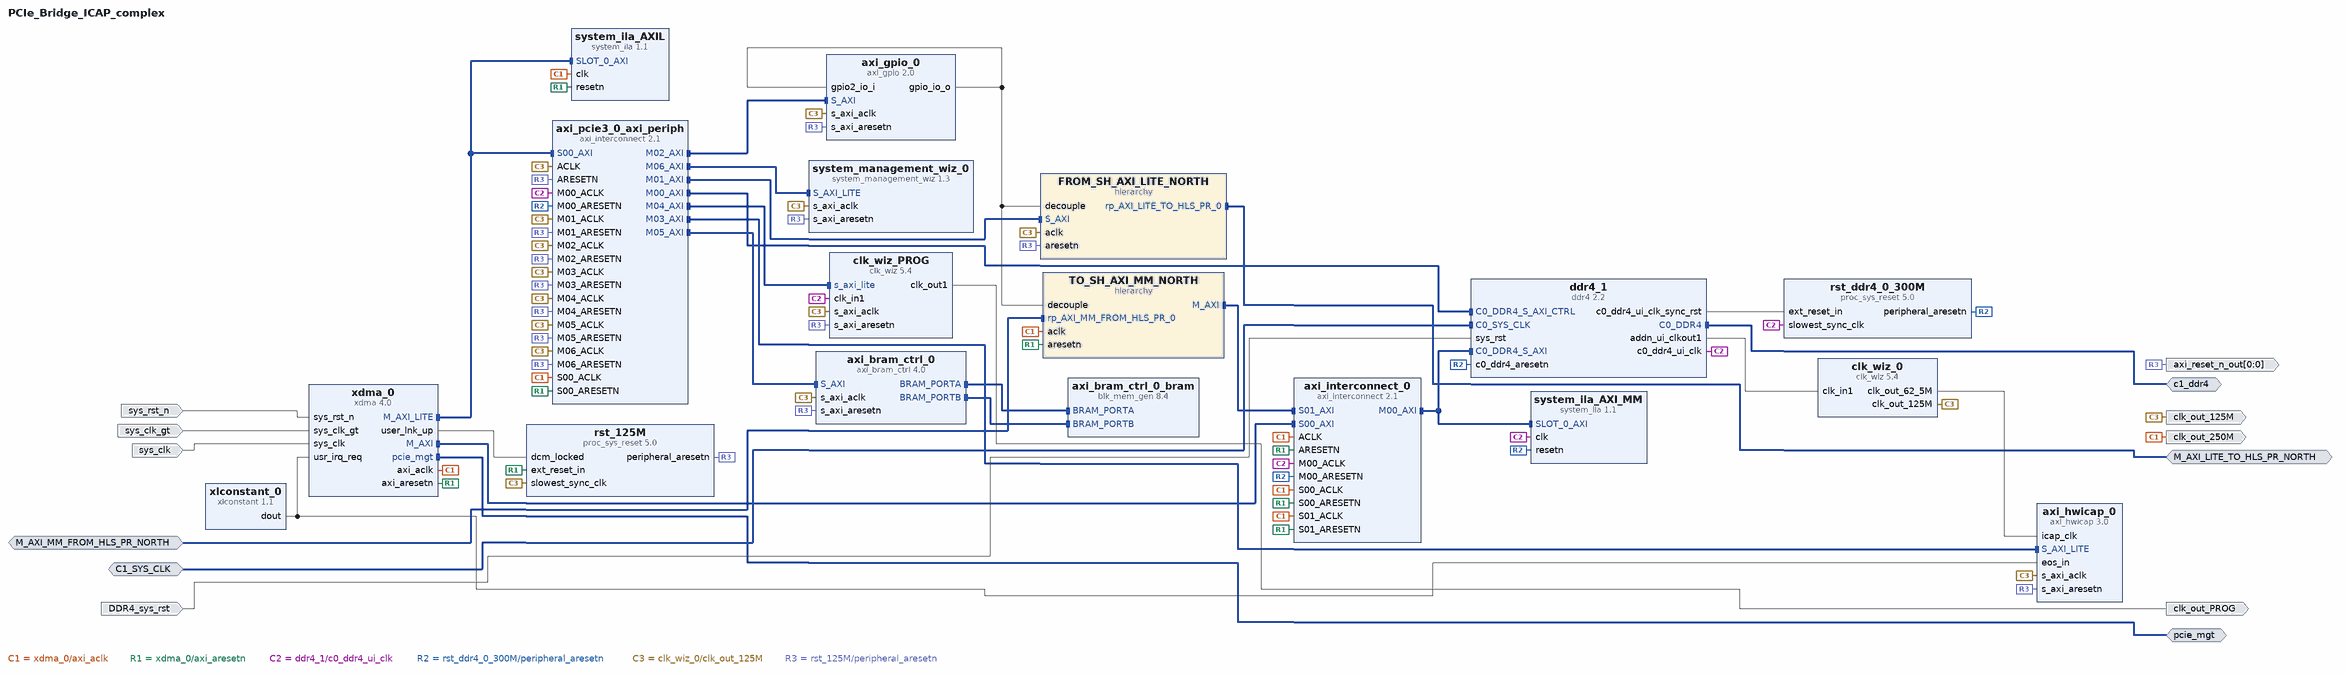
[diagram p0: block diagram of the top level]
# Vivado block design PCIe_Bridge_ICAP_complex, xcvu9p-fsgd2104-2-i, Vivado 2017.4
create_bd_design PCIe_Bridge_ICAP_complex

create_bd_intf_port -mode Master -vlnv xilinx.com:interface:pcie_7x_mgt_rtl:1.0 pcie_mgt
create_bd_intf_port -mode Master -vlnv xilinx.com:interface:ddr4_rtl:1.0 c1_ddr4
create_bd_intf_port -mode Slave -vlnv xilinx.com:interface:aximm_rtl:1.0 M_AXI_MM_FROM_HLS_PR_NORTH
set_property -dict [list \
  CONFIG.DATA_WIDTH 512 \
  CONFIG.PROTOCOL AXI4 \
  CONFIG.ID_WIDTH 0 \
  CONFIG.ADDR_WIDTH 64 \
  CONFIG.AWUSER_WIDTH 0 \
  CONFIG.ARUSER_WIDTH 0 \
  CONFIG.WUSER_WIDTH 0 \
  CONFIG.RUSER_WIDTH 0 \
  CONFIG.BUSER_WIDTH 0 \
  CONFIG.READ_WRITE_MODE READ_WRITE \
  CONFIG.HAS_BURST 1 \
  CONFIG.HAS_LOCK 1 \
  CONFIG.HAS_PROT 1 \
  CONFIG.HAS_CACHE 1 \
  CONFIG.HAS_QOS 1 \
  CONFIG.HAS_REGION 1 \
  CONFIG.HAS_WSTRB 1 \
  CONFIG.HAS_BRESP 1 \
  CONFIG.HAS_RRESP 1 \
  CONFIG.SUPPORTS_NARROW_BURST 1 \
  CONFIG.NUM_READ_OUTSTANDING 32 \
  CONFIG.NUM_WRITE_OUTSTANDING 32 \
  CONFIG.MAX_BURST_LENGTH 256 \
  CONFIG.NUM_READ_THREADS 1 \
  CONFIG.NUM_WRITE_THREADS 1 \
  CONFIG.RUSER_BITS_PER_BYTE 0 \
  CONFIG.WUSER_BITS_PER_BYTE 0 \
] [get_bd_intf_ports M_AXI_MM_FROM_HLS_PR_NORTH]
create_bd_intf_port -mode Master -vlnv xilinx.com:interface:aximm_rtl:1.0 M_AXI_LITE_TO_HLS_PR_NORTH
set_property -dict [list \
  CONFIG.DATA_WIDTH 32 \
  CONFIG.PROTOCOL AXI4LITE \
  CONFIG.ADDR_WIDTH 32 \
  CONFIG.HAS_BURST 0 \
  CONFIG.HAS_QOS 0 \
  CONFIG.HAS_REGION 0 \
] [get_bd_intf_ports M_AXI_LITE_TO_HLS_PR_NORTH]
create_bd_intf_port -mode Slave -vlnv xilinx.com:interface:diff_clock_rtl:1.0 C1_SYS_CLK
set_property -dict {CONFIG.FREQ_HZ 300000000} [get_bd_intf_ports C1_SYS_CLK]
create_bd_port -dir O -type clk clk_out_250M
set_property -dict {CONFIG.ASSOCIATED_BUSIF M_AXI_MM_FROM_HLS_PR_NORTH} [get_bd_ports clk_out_250M]
create_bd_port -dir I -type rst DDR4_sys_rst
set_property -dict {CONFIG.POLARITY ACTIVE_HIGH} [get_bd_ports DDR4_sys_rst]
create_bd_port -dir I -type rst sys_rst_n
create_bd_port -dir I -type clk sys_clk_gt
create_bd_port -dir I -type clk sys_clk
create_bd_port -dir O -type clk clk_out_125M
set_property -dict [list \
  CONFIG.ASSOCIATED_BUSIF M_AXI_LITE_TO_HLS_PR_NORTH \
  CONFIG.ASSOCIATED_RESET axi_reset_n_out \
] [get_bd_ports clk_out_125M]
create_bd_port -dir O -from 0 -to 0 -type rst axi_reset_n_out
create_bd_port -dir O -type clk clk_out_PROG
set_property -dict {CONFIG.FREQ_HZ 400000000} [get_bd_ports clk_out_PROG]

create_bd_cell -type hier TO_SH_AXI_MM_NORTH
create_bd_cell -type hier FROM_SH_AXI_LITE_NORTH
create_bd_cell -type ip -vlnv xilinx.com:ip:axi_gpio:2.0 axi_gpio_0
set_property -dict [list \
  CONFIG.C_GPIO_WIDTH 1 \
  CONFIG.C_GPIO2_WIDTH 1 \
  CONFIG.C_IS_DUAL 1 \
  CONFIG.C_ALL_INPUTS_2 1 \
  CONFIG.C_ALL_OUTPUTS 1 \
] [get_bd_cells axi_gpio_0]
create_bd_cell -type ip -vlnv xilinx.com:ip:axi_hwicap:3.0 axi_hwicap_0
set_property -dict {CONFIG.C_FAMILY kintexu} [get_bd_cells axi_hwicap_0]
create_bd_cell -type ip -vlnv xilinx.com:ip:axi_interconnect:2.1 axi_interconnect_0
set_property -dict [list \
  CONFIG.NUM_SI 2 \
  CONFIG.NUM_MI 1 \
  CONFIG.SYNCHRONIZATION_STAGES 2 \
  CONFIG.M00_HAS_REGSLICE 4 \
  CONFIG.M01_HAS_REGSLICE 4 \
  CONFIG.M00_HAS_DATA_FIFO 0 \
  CONFIG.S00_HAS_REGSLICE 4 \
  CONFIG.S01_HAS_REGSLICE 4 \
  CONFIG.S02_HAS_REGSLICE 4 \
  CONFIG.S03_HAS_REGSLICE 4 \
  CONFIG.S00_HAS_DATA_FIFO 0 \
  CONFIG.S01_HAS_DATA_FIFO 0 \
  CONFIG.S02_HAS_DATA_FIFO 0 \
  CONFIG.S03_HAS_DATA_FIFO 0 \
] [get_bd_cells axi_interconnect_0]
create_bd_cell -type ip -vlnv xilinx.com:ip:axi_interconnect:2.1 axi_pcie3_0_axi_periph
set_property -dict [list \
  CONFIG.NUM_MI 7 \
  CONFIG.SYNCHRONIZATION_STAGES 2 \
  CONFIG.M00_HAS_REGSLICE 4 \
  CONFIG.M01_HAS_REGSLICE 4 \
  CONFIG.M02_HAS_REGSLICE 4 \
  CONFIG.M03_HAS_REGSLICE 4 \
  CONFIG.M04_HAS_REGSLICE 4 \
  CONFIG.S00_HAS_REGSLICE 4 \
] [get_bd_cells axi_pcie3_0_axi_periph]
create_bd_cell -type ip -vlnv xilinx.com:ip:clk_wiz:5.4 clk_wiz_0
set_property -dict [list \
  CONFIG.USE_FREQ_SYNTH true \
  CONFIG.USE_PHASE_ALIGNMENT false \
  CONFIG.JITTER_SEL Min_O_Jitter \
  CONFIG.PHASESHIFT_MODE WAVEFORM \
  CONFIG.SECONDARY_SOURCE Single_ended_clock_capable_pin \
  CONFIG.CLKIN1_JITTER_PS 40.0 \
  CONFIG.CLKOUT2_USED true \
  CONFIG.CLKOUT3_USED false \
  CONFIG.NUM_OUT_CLKS 2 \
  CONFIG.CLK_OUT1_PORT clk_out_125M \
  CONFIG.CLK_OUT2_PORT clk_out_62_5M \
  CONFIG.CLK_OUT3_PORT clk_out3 \
  CONFIG.CLKOUT1_REQUESTED_OUT_FREQ 125.000 \
  CONFIG.CLKOUT2_REQUESTED_OUT_FREQ 62.5 \
  CONFIG.CLKOUT3_REQUESTED_OUT_FREQ 100.000 \
  CONFIG.PRIM_SOURCE No_buffer \
  CONFIG.CLKOUT1_DRIVES BUFG \
  CONFIG.CLKOUT2_DRIVES BUFG \
  CONFIG.CLKOUT3_DRIVES Buffer \
  CONFIG.CLKOUT4_DRIVES Buffer \
  CONFIG.CLKOUT5_DRIVES Buffer \
  CONFIG.CLKOUT6_DRIVES Buffer \
  CONFIG.CLKOUT7_DRIVES Buffer \
  CONFIG.FEEDBACK_SOURCE FDBK_AUTO \
  CONFIG.USE_LOCKED false \
  CONFIG.USE_RESET false \
  CONFIG.MMCM_DIVCLK_DIVIDE 1 \
  CONFIG.MMCM_BANDWIDTH HIGH \
  CONFIG.MMCM_CLKFBOUT_MULT_F 6.250 \
  CONFIG.MMCM_CLKIN1_PERIOD 4.000 \
  CONFIG.MMCM_CLKIN2_PERIOD 10.0 \
  CONFIG.MMCM_CLKOUT0_DIVIDE_F 12.500 \
  CONFIG.MMCM_CLKOUT1_DIVIDE 25 \
  CONFIG.MMCM_CLKOUT2_DIVIDE 1 \
  CONFIG.CLKOUT1_JITTER 88.976 \
  CONFIG.CLKOUT1_PHASE_ERROR 71.064 \
  CONFIG.CLKOUT2_JITTER 101.705 \
  CONFIG.CLKOUT2_PHASE_ERROR 71.064 \
  CONFIG.CLKOUT3_JITTER 79.446 \
  CONFIG.CLKOUT3_PHASE_ERROR 72.667 \
] [get_bd_cells clk_wiz_0]
create_bd_cell -type ip -vlnv xilinx.com:ip:clk_wiz:5.4 clk_wiz_PROG
set_property -dict [list \
  CONFIG.USE_PHASE_ALIGNMENT false \
  CONFIG.USE_DYN_RECONFIG true \
  CONFIG.JITTER_SEL Min_O_Jitter \
  CONFIG.SECONDARY_SOURCE Single_ended_clock_capable_pin \
  CONFIG.CLKIN1_JITTER_PS 33.330000000000005 \
  CONFIG.CLKOUT1_REQUESTED_OUT_FREQ 400.000 \
  CONFIG.PRIM_SOURCE No_buffer \
  CONFIG.CLKOUT1_DRIVES Buffer \
  CONFIG.CLKOUT2_DRIVES Buffer \
  CONFIG.CLKOUT3_DRIVES Buffer \
  CONFIG.CLKOUT4_DRIVES Buffer \
  CONFIG.CLKOUT5_DRIVES Buffer \
  CONFIG.CLKOUT6_DRIVES Buffer \
  CONFIG.CLKOUT7_DRIVES Buffer \
  CONFIG.MMCM_DIVCLK_DIVIDE 3 \
  CONFIG.MMCM_BANDWIDTH HIGH \
  CONFIG.MMCM_CLKFBOUT_MULT_F 15.500 \
  CONFIG.MMCM_CLKIN1_PERIOD 3.333 \
  CONFIG.MMCM_CLKIN2_PERIOD 10.0 \
  CONFIG.MMCM_CLKOUT0_DIVIDE_F 3.875 \
  CONFIG.CLKOUT1_JITTER 71.763 \
  CONFIG.CLKOUT1_PHASE_ERROR 75.042 \
] [get_bd_cells clk_wiz_PROG]
create_bd_cell -type ip -vlnv xilinx.com:ip:ddr4:2.2 ddr4_1
set_property -dict [list \
  CONFIG.C0.DDR4_TimePeriod 833 \
  CONFIG.C0.DDR4_InputClockPeriod 3332 \
  CONFIG.C0.DDR4_MemoryType RDIMMs \
  CONFIG.C0.DDR4_MemoryPart MTA18ASF2G72PZ-2G3 \
  CONFIG.C0.DDR4_DataWidth 72 \
  CONFIG.C0.DDR4_CasLatency 17 \
  CONFIG.C0.DDR4_CasWriteLatency 12 \
  CONFIG.C0.DDR4_AxiDataWidth 512 \
  CONFIG.C0.DDR4_AxiAddressWidth 34 \
  CONFIG.ADDN_UI_CLKOUT1_FREQ_HZ 250 \
  CONFIG.C0.BANK_GROUP_WIDTH 2 \
  CONFIG.C0.CKE_WIDTH 1 \
  CONFIG.C0.CS_WIDTH 1 \
  CONFIG.C0.ODT_WIDTH 1 \
] [get_bd_cells ddr4_1]
create_bd_cell -type ip -vlnv xilinx.com:ip:proc_sys_reset:5.0 rst_ddr4_0_300M
create_bd_cell -type ip -vlnv xilinx.com:ip:proc_sys_reset:5.0 rst_125M
create_bd_cell -type ip -vlnv xilinx.com:ip:system_ila:1.1 system_ila_AXI_MM
set_property -dict [list \
  CONFIG.C_SLOT_0_MAX_RD_BURSTS 32 \
  CONFIG.C_SLOT_0_MAX_WR_BURSTS 32 \
  CONFIG.C_SLOT_0_TXN_CNTR_EN 0 \
  CONFIG.C_SLOT_0_AXI_W_SEL_TRIG 0 \
  CONFIG.C_SLOT_0_AXI_B_SEL_TRIG 0 \
  CONFIG.C_SLOT_0_AXI_R_SEL_TRIG 0 \
  CONFIG.C_INPUT_PIPE_STAGES 4 \
  CONFIG.ALL_PROBE_SAME_MU true \
  CONFIG.C_MON_TYPE INTERFACE \
] [get_bd_cells system_ila_AXI_MM]
create_bd_cell -type ip -vlnv xilinx.com:ip:xdma:4.0 xdma_0
set_property -dict [list \
  CONFIG.mode_selection Advanced \
  CONFIG.pcie_blk_locn X1Y2 \
  CONFIG.pl_link_cap_max_link_width X16 \
  CONFIG.pl_link_cap_max_link_speed 8.0_GT/s \
  CONFIG.axi_data_width 512_bit \
  CONFIG.axisten_freq 250 \
  CONFIG.pipe_sim false \
  CONFIG.pf0_device_id 903F \
  CONFIG.axilite_master_en true \
  CONFIG.axilite_master_size 32 \
  CONFIG.axilite_master_scale Megabytes \
  CONFIG.pf0_interrupt_pin NONE \
  CONFIG.pf0_msi_enabled true \
  CONFIG.plltype QPLL1 \
  CONFIG.pf0_msix_enabled true \
  CONFIG.pf0_msix_cap_table_size 020 \
  CONFIG.pf0_msix_cap_table_offset 00008000 \
  CONFIG.pf0_msix_cap_table_bir BAR_1 \
  CONFIG.pf0_msix_cap_pba_offset 00008FE0 \
  CONFIG.pf0_msix_cap_pba_bir BAR_1 \
  CONFIG.cfg_mgmt_if false \
] [get_bd_cells xdma_0]
create_bd_cell -type ip -vlnv xilinx.com:ip:xlconstant:1.1 xlconstant_0
set_property -dict {CONFIG.CONST_VAL 0} [get_bd_cells xlconstant_0]
create_bd_cell -type ip -vlnv xilinx.com:ip:axi_bram_ctrl:4.0 axi_bram_ctrl_0
create_bd_cell -type ip -vlnv xilinx.com:ip:blk_mem_gen:8.4 axi_bram_ctrl_0_bram
set_property -dict {CONFIG.Memory_Type True_Dual_Port_RAM} [get_bd_cells axi_bram_ctrl_0_bram]
create_bd_cell -type ip -vlnv xilinx.com:ip:system_ila:1.1 system_ila_AXIL
create_bd_cell -type ip -vlnv xilinx.com:ip:system_management_wiz:1.3 system_management_wiz_0
set_property -dict [list \
  CONFIG.TEMPERATURE_ALARM_OT_TRIGGER 95.0 \
  CONFIG.CHANNEL_ENABLE_VP_VN false \
] [get_bd_cells system_management_wiz_0]

# ---- hierarchy /TO_SH_AXI_MM_NORTH ----
current_bd_instance /TO_SH_AXI_MM_NORTH
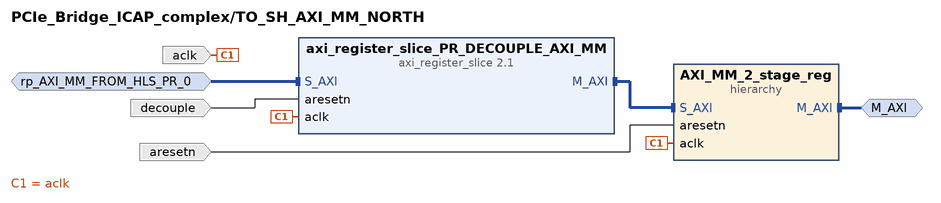
[diagram p1: block diagram inside /TO_SH_AXI_MM_NORTH]
create_bd_intf_pin -mode Master -vlnv xilinx.com:interface:aximm_rtl:1.0 M_AXI
create_bd_intf_pin -mode Slave -vlnv xilinx.com:interface:aximm_rtl:1.0 rp_AXI_MM_FROM_HLS_PR_0
create_bd_pin -dir I -type clk aclk
create_bd_pin -dir I -type rst aresetn
create_bd_pin -dir I decouple

create_bd_cell -type hier AXI_MM_2_stage_reg
create_bd_cell -type ip -vlnv xilinx.com:ip:axi_register_slice:2.1 axi_register_slice_PR_DECOUPLE_AXI_MM

# ---- hierarchy /TO_SH_AXI_MM_NORTH/AXI_MM_2_stage_reg ----
current_bd_instance /TO_SH_AXI_MM_NORTH/AXI_MM_2_stage_reg
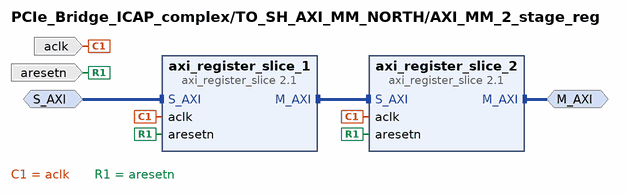
[diagram p2: block diagram inside /TO_SH_AXI_MM_NORTH/AXI_MM_2_stage_reg]
create_bd_intf_pin -mode Master -vlnv xilinx.com:interface:aximm_rtl:1.0 M_AXI
create_bd_intf_pin -mode Slave -vlnv xilinx.com:interface:aximm_rtl:1.0 S_AXI
create_bd_pin -dir I -type clk aclk
create_bd_pin -dir I -type rst aresetn

create_bd_cell -type ip -vlnv xilinx.com:ip:axi_register_slice:2.1 axi_register_slice_1
create_bd_cell -type ip -vlnv xilinx.com:ip:axi_register_slice:2.1 axi_register_slice_2

# ---- hierarchy /FROM_SH_AXI_LITE_NORTH ----
current_bd_instance /FROM_SH_AXI_LITE_NORTH
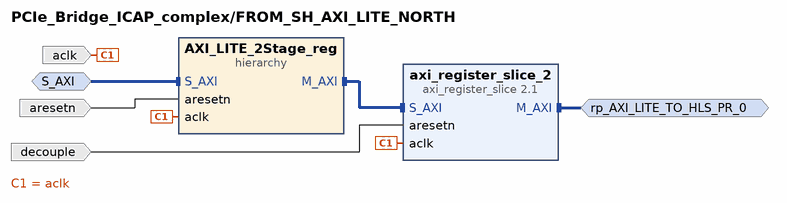
[diagram p3: block diagram inside /FROM_SH_AXI_LITE_NORTH]
create_bd_intf_pin -mode Slave -vlnv xilinx.com:interface:aximm_rtl:1.0 S_AXI
create_bd_intf_pin -mode Master -vlnv xilinx.com:interface:aximm_rtl:1.0 rp_AXI_LITE_TO_HLS_PR_0
create_bd_pin -dir I -type clk aclk
create_bd_pin -dir I -type rst aresetn
create_bd_pin -dir I decouple

create_bd_cell -type hier AXI_LITE_2Stage_reg
create_bd_cell -type ip -vlnv xilinx.com:ip:axi_register_slice:2.1 axi_register_slice_2
set_property -dict {CONFIG.REG_W 7 CONFIG.REG_R 7} [get_bd_cells axi_register_slice_2]

# ---- hierarchy /FROM_SH_AXI_LITE_NORTH/AXI_LITE_2Stage_reg ----
current_bd_instance /FROM_SH_AXI_LITE_NORTH/AXI_LITE_2Stage_reg
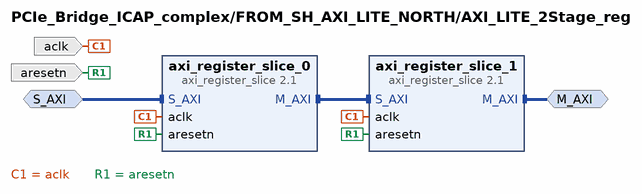
[diagram p4: block diagram inside /FROM_SH_AXI_LITE_NORTH/AXI_LITE_2Stage_reg]
create_bd_intf_pin -mode Slave -vlnv xilinx.com:interface:aximm_rtl:1.0 S_AXI
create_bd_intf_pin -mode Master -vlnv xilinx.com:interface:aximm_rtl:1.0 M_AXI
create_bd_pin -dir I -type clk aclk
create_bd_pin -dir I -type rst aresetn

create_bd_cell -type ip -vlnv xilinx.com:ip:axi_register_slice:2.1 axi_register_slice_0
set_property -dict {CONFIG.REG_W 7 CONFIG.REG_R 7} [get_bd_cells axi_register_slice_0]
create_bd_cell -type ip -vlnv xilinx.com:ip:axi_register_slice:2.1 axi_register_slice_1
set_property -dict {CONFIG.REG_W 7 CONFIG.REG_R 7} [get_bd_cells axi_register_slice_1]

# ---- connections ----

current_bd_instance /TO_SH_AXI_MM_NORTH
connect_bd_intf_net -intf_net axi_register_slice_0_M_AXI [get_bd_intf_pins axi_register_slice_PR_DECOUPLE_AXI_MM/M_AXI] [get_bd_intf_pins AXI_MM_2_stage_reg/S_AXI]
connect_bd_intf_net -intf_net AXI_MM_3_stage_reg_M_AXI [get_bd_intf_pins M_AXI] [get_bd_intf_pins AXI_MM_2_stage_reg/M_AXI]
connect_bd_intf_net -intf_net rp_AXI_MM_FROM_HLS_PR_0_1 [get_bd_intf_pins rp_AXI_MM_FROM_HLS_PR_0] [get_bd_intf_pins axi_register_slice_PR_DECOUPLE_AXI_MM/S_AXI]
connect_bd_net -net clk_wiz_0_clk_out_125M [get_bd_pins aclk] \
  [get_bd_pins axi_register_slice_PR_DECOUPLE_AXI_MM/aclk] [get_bd_pins AXI_MM_2_stage_reg/aclk]
connect_bd_net -net rst_ddr4_0_300M1_peripheral_aresetn [get_bd_pins aresetn] [get_bd_pins AXI_MM_2_stage_reg/aresetn]
connect_bd_net [get_bd_pins decouple] [get_bd_pins axi_register_slice_PR_DECOUPLE_AXI_MM/aresetn]

current_bd_instance /TO_SH_AXI_MM_NORTH/AXI_MM_2_stage_reg
connect_bd_intf_net [get_bd_intf_pins axi_register_slice_2/S_AXI] [get_bd_intf_pins axi_register_slice_1/M_AXI]
connect_bd_intf_net [get_bd_intf_pins M_AXI] [get_bd_intf_pins axi_register_slice_2/M_AXI]
connect_bd_intf_net [get_bd_intf_pins S_AXI] [get_bd_intf_pins axi_register_slice_1/S_AXI]
connect_bd_net -net axi_pcie3_0_axi_aclk [get_bd_pins aclk] [get_bd_pins axi_register_slice_1/aclk] [get_bd_pins axi_register_slice_2/aclk]
connect_bd_net -net axi_pcie3_0_axi_aresetn [get_bd_pins aresetn] \
  [get_bd_pins axi_register_slice_1/aresetn] [get_bd_pins axi_register_slice_2/aresetn]

current_bd_instance /FROM_SH_AXI_LITE_NORTH
connect_bd_intf_net -intf_net AXI_LITE_3Stage_reg_M_AXI [get_bd_intf_pins axi_register_slice_2/S_AXI] [get_bd_intf_pins AXI_LITE_2Stage_reg/M_AXI]
connect_bd_intf_net [get_bd_intf_pins S_AXI] [get_bd_intf_pins AXI_LITE_2Stage_reg/S_AXI]
connect_bd_intf_net [get_bd_intf_pins rp_AXI_LITE_TO_HLS_PR_0] [get_bd_intf_pins axi_register_slice_2/M_AXI]
connect_bd_net -net clk_wiz_0_clk_out_125M [get_bd_pins aclk] [get_bd_pins axi_register_slice_2/aclk] [get_bd_pins AXI_LITE_2Stage_reg/aclk]
connect_bd_net -net rst_ddr4_0_300M1_peripheral_aresetn [get_bd_pins aresetn] [get_bd_pins AXI_LITE_2Stage_reg/aresetn]
connect_bd_net [get_bd_pins decouple] [get_bd_pins axi_register_slice_2/aresetn]

current_bd_instance /FROM_SH_AXI_LITE_NORTH/AXI_LITE_2Stage_reg
connect_bd_intf_net [get_bd_intf_pins axi_register_slice_1/S_AXI] [get_bd_intf_pins axi_register_slice_0/M_AXI]
connect_bd_intf_net [get_bd_intf_pins S_AXI] [get_bd_intf_pins axi_register_slice_0/S_AXI]
connect_bd_intf_net [get_bd_intf_pins M_AXI] [get_bd_intf_pins axi_register_slice_1/M_AXI]
connect_bd_net [get_bd_pins aclk] [get_bd_pins axi_register_slice_0/aclk] [get_bd_pins axi_register_slice_1/aclk]
connect_bd_net [get_bd_pins aresetn] [get_bd_pins axi_register_slice_0/aresetn] [get_bd_pins axi_register_slice_1/aresetn]

current_bd_instance /
connect_bd_intf_net [get_bd_intf_pins axi_pcie3_0_axi_periph/S00_AXI] [get_bd_intf_pins xdma_0/M_AXI_LITE]
connect_bd_intf_net [get_bd_intf_pins axi_pcie3_0_axi_periph/S00_AXI] [get_bd_intf_pins system_ila_AXIL/SLOT_0_AXI]
connect_bd_intf_net [get_bd_intf_pins axi_interconnect_0/M00_AXI] [get_bd_intf_pins ddr4_1/C0_DDR4_S_AXI]
connect_bd_intf_net [get_bd_intf_pins axi_interconnect_0/M00_AXI] [get_bd_intf_pins system_ila_AXI_MM/SLOT_0_AXI]
connect_bd_intf_net [get_bd_intf_pins FROM_SH_AXI_LITE_NORTH/S_AXI] [get_bd_intf_pins axi_pcie3_0_axi_periph/M01_AXI]
connect_bd_intf_net -intf_net fifo_generator_1_M_AXI [get_bd_intf_pins TO_SH_AXI_MM_NORTH/M_AXI] [get_bd_intf_pins axi_interconnect_0/S01_AXI]
connect_bd_intf_net [get_bd_intf_pins axi_hwicap_0/S_AXI_LITE] [get_bd_intf_pins axi_pcie3_0_axi_periph/M03_AXI]
connect_bd_intf_net [get_bd_intf_pins axi_gpio_0/S_AXI] [get_bd_intf_pins axi_pcie3_0_axi_periph/M02_AXI]
connect_bd_intf_net [get_bd_intf_pins axi_pcie3_0_axi_periph/M00_AXI] [get_bd_intf_pins ddr4_1/C0_DDR4_S_AXI_CTRL]
connect_bd_intf_net [get_bd_intf_pins axi_interconnect_0/S00_AXI] [get_bd_intf_pins xdma_0/M_AXI]
connect_bd_intf_net [get_bd_intf_pins axi_pcie3_0_axi_periph/M04_AXI] [get_bd_intf_pins clk_wiz_PROG/s_axi_lite]
connect_bd_intf_net [get_bd_intf_pins axi_bram_ctrl_0_bram/BRAM_PORTA] [get_bd_intf_pins axi_bram_ctrl_0/BRAM_PORTA]
connect_bd_intf_net [get_bd_intf_pins axi_bram_ctrl_0_bram/BRAM_PORTB] [get_bd_intf_pins axi_bram_ctrl_0/BRAM_PORTB]
connect_bd_intf_net [get_bd_intf_pins axi_pcie3_0_axi_periph/M05_AXI] [get_bd_intf_pins axi_bram_ctrl_0/S_AXI]
connect_bd_intf_net [get_bd_intf_pins axi_pcie3_0_axi_periph/M06_AXI] [get_bd_intf_pins system_management_wiz_0/S_AXI_LITE]
connect_bd_intf_net [get_bd_intf_ports pcie_mgt] [get_bd_intf_pins xdma_0/pcie_mgt]
connect_bd_intf_net -intf_net ddr4_0_C0_DDR4 [get_bd_intf_ports c1_ddr4] [get_bd_intf_pins ddr4_1/C0_DDR4]
connect_bd_intf_net -intf_net M_AXI_MM_FROM_HLS_PR_0_1 [get_bd_intf_ports M_AXI_MM_FROM_HLS_PR_NORTH] [get_bd_intf_pins TO_SH_AXI_MM_NORTH/rp_AXI_MM_FROM_HLS_PR_0]
connect_bd_intf_net -intf_net FROM_SH_AXI_LITE_rp_AXI_LITE_TO_HLS_PR_0 [get_bd_intf_ports M_AXI_LITE_TO_HLS_PR_NORTH] [get_bd_intf_pins FROM_SH_AXI_LITE_NORTH/rp_AXI_LITE_TO_HLS_PR_0]
connect_bd_intf_net [get_bd_intf_ports C1_SYS_CLK] [get_bd_intf_pins ddr4_1/C0_SYS_CLK]
connect_bd_net -net axi_pcie3_0_axi_aclk [get_bd_pins xdma_0/axi_aclk] \
  [get_bd_ports clk_out_250M] [get_bd_pins system_ila_AXIL/clk] [get_bd_pins TO_SH_AXI_MM_NORTH/aclk] \
  [get_bd_pins axi_interconnect_0/ACLK] [get_bd_pins axi_interconnect_0/S00_ACLK] [get_bd_pins axi_interconnect_0/S01_ACLK] \
  [get_bd_pins axi_pcie3_0_axi_periph/S00_ACLK]
connect_bd_net -net axi_pcie3_0_axi_aresetn [get_bd_pins xdma_0/axi_aresetn] \
  [get_bd_pins rst_125M/ext_reset_in] [get_bd_pins system_ila_AXIL/resetn] [get_bd_pins TO_SH_AXI_MM_NORTH/aresetn] \
  [get_bd_pins axi_interconnect_0/ARESETN] [get_bd_pins axi_interconnect_0/S00_ARESETN] \
  [get_bd_pins axi_interconnect_0/S01_ARESETN] [get_bd_pins axi_pcie3_0_axi_periph/S00_ARESETN]
connect_bd_net -net ddr4_0_c0_ddr4_ui_clk [get_bd_pins ddr4_1/c0_ddr4_ui_clk] \
  [get_bd_pins clk_wiz_PROG/clk_in1] [get_bd_pins rst_ddr4_0_300M/slowest_sync_clk] [get_bd_pins system_ila_AXI_MM/clk] \
  [get_bd_pins axi_interconnect_0/M00_ACLK] [get_bd_pins axi_pcie3_0_axi_periph/M00_ACLK]
connect_bd_net -net ddr4_0_c0_ddr4_ui_clk_sync_rst [get_bd_pins ddr4_1/c0_ddr4_ui_clk_sync_rst] [get_bd_pins rst_ddr4_0_300M/ext_reset_in]
connect_bd_net [get_bd_pins rst_ddr4_0_300M/peripheral_aresetn] \
  [get_bd_pins ddr4_1/c0_ddr4_aresetn] [get_bd_pins system_ila_AXI_MM/resetn] [get_bd_pins axi_interconnect_0/M00_ARESETN] \
  [get_bd_pins axi_pcie3_0_axi_periph/M00_ARESETN]
connect_bd_net -net sys_rst_1 [get_bd_ports DDR4_sys_rst] [get_bd_pins ddr4_1/sys_rst]
connect_bd_net [get_bd_pins xlconstant_0/dout] [get_bd_pins xdma_0/usr_irq_req] [get_bd_pins axi_hwicap_0/eos_in]
connect_bd_net [get_bd_ports sys_rst_n] [get_bd_pins xdma_0/sys_rst_n]
connect_bd_net [get_bd_ports sys_clk_gt] [get_bd_pins xdma_0/sys_clk_gt]
connect_bd_net [get_bd_ports sys_clk] [get_bd_pins xdma_0/sys_clk]
connect_bd_net [get_bd_pins clk_wiz_0/clk_out_125M] \
  [get_bd_ports clk_out_125M] [get_bd_pins axi_gpio_0/s_axi_aclk] [get_bd_pins axi_hwicap_0/s_axi_aclk] \
  [get_bd_pins clk_wiz_PROG/s_axi_aclk] [get_bd_pins rst_125M/slowest_sync_clk] [get_bd_pins axi_bram_ctrl_0/s_axi_aclk] \
  [get_bd_pins FROM_SH_AXI_LITE_NORTH/aclk] [get_bd_pins axi_pcie3_0_axi_periph/ACLK] \
  [get_bd_pins axi_pcie3_0_axi_periph/M01_ACLK] [get_bd_pins axi_pcie3_0_axi_periph/M02_ACLK] \
  [get_bd_pins axi_pcie3_0_axi_periph/M03_ACLK] [get_bd_pins axi_pcie3_0_axi_periph/M04_ACLK] \
  [get_bd_pins axi_pcie3_0_axi_periph/M05_ACLK] [get_bd_pins system_management_wiz_0/s_axi_aclk] \
  [get_bd_pins axi_pcie3_0_axi_periph/M06_ACLK]
connect_bd_net [get_bd_pins clk_wiz_0/clk_out_62_5M] [get_bd_pins axi_hwicap_0/icap_clk]
connect_bd_net -net rst_ddr4_0_300M1_peripheral_aresetn [get_bd_pins rst_125M/peripheral_aresetn] \
  [get_bd_ports axi_reset_n_out] [get_bd_pins axi_gpio_0/s_axi_aresetn] [get_bd_pins axi_hwicap_0/s_axi_aresetn] \
  [get_bd_pins clk_wiz_PROG/s_axi_aresetn] [get_bd_pins axi_bram_ctrl_0/s_axi_aresetn] \
  [get_bd_pins FROM_SH_AXI_LITE_NORTH/aresetn] [get_bd_pins axi_pcie3_0_axi_periph/ARESETN] \
  [get_bd_pins axi_pcie3_0_axi_periph/M01_ARESETN] [get_bd_pins axi_pcie3_0_axi_periph/M02_ARESETN] \
  [get_bd_pins axi_pcie3_0_axi_periph/M03_ARESETN] [get_bd_pins axi_pcie3_0_axi_periph/M04_ARESETN] \
  [get_bd_pins axi_pcie3_0_axi_periph/M05_ARESETN] [get_bd_pins system_management_wiz_0/s_axi_aresetn] \
  [get_bd_pins axi_pcie3_0_axi_periph/M06_ARESETN]
connect_bd_net -net xlslice_0_Dout [get_bd_pins axi_gpio_0/gpio_io_o] \
  [get_bd_pins axi_gpio_0/gpio2_io_i] [get_bd_pins TO_SH_AXI_MM_NORTH/decouple] [get_bd_pins FROM_SH_AXI_LITE_NORTH/decouple]
connect_bd_net -net clk_wiz_1_clk_out1 [get_bd_pins clk_wiz_PROG/clk_out1] [get_bd_ports clk_out_PROG]
connect_bd_net [get_bd_pins ddr4_1/addn_ui_clkout1] [get_bd_pins clk_wiz_0/clk_in1]
connect_bd_net [get_bd_pins xdma_0/user_lnk_up] [get_bd_pins rst_125M/dcm_locked]

# ---- address map ----
assign_bd_address -offset 0x0000000000000000 -range 4G -target_address_space [get_bd_addr_spaces M_AXI_MM_FROM_HLS_PR_NORTH] [get_bd_addr_segs ddr4_1/C0_DDR4_MEMORY_MAP/C0_DDR4_ADDRESS_BLOCK]
assign_bd_address -offset 0x0000000000000000 -range 4G -target_address_space [get_bd_addr_spaces xdma_0/M_AXI] [get_bd_addr_segs ddr4_1/C0_DDR4_MEMORY_MAP/C0_DDR4_ADDRESS_BLOCK]
assign_bd_address -offset 0x00010000 -range 64K -target_address_space [get_bd_addr_spaces xdma_0/M_AXI_LITE] [get_bd_addr_segs axi_gpio_0/S_AXI/Reg]
assign_bd_address -offset 0x00020000 -range 64K -target_address_space [get_bd_addr_spaces xdma_0/M_AXI_LITE] [get_bd_addr_segs clk_wiz_PROG/s_axi_lite/Reg]
assign_bd_address -offset 0x00030000 -range 64K -target_address_space [get_bd_addr_spaces xdma_0/M_AXI_LITE] [get_bd_addr_segs axi_hwicap_0/S_AXI_LITE/Reg]
assign_bd_address -offset 0x00040000 -range 64K -target_address_space [get_bd_addr_spaces xdma_0/M_AXI_LITE] [get_bd_addr_segs M_AXI_LITE_TO_HLS_PR_NORTH/Reg]
assign_bd_address -offset 0x00050000 -range 64K -target_address_space [get_bd_addr_spaces xdma_0/M_AXI_LITE] [get_bd_addr_segs system_management_wiz_0/S_AXI_LITE/Reg]
assign_bd_address -offset 0x000E0000 -range 64K -target_address_space [get_bd_addr_spaces xdma_0/M_AXI_LITE] [get_bd_addr_segs ddr4_1/C0_DDR4_MEMORY_MAP_CTRL/C0_REG]
assign_bd_address -offset 0x000F0000 -range 8K -target_address_space [get_bd_addr_spaces xdma_0/M_AXI_LITE] [get_bd_addr_segs axi_bram_ctrl_0/S_AXI/Mem0]

validate_bd_design
save_bd_design
